# Altium schematic sheet POWER_POSITIVE.SchDoc
size A4; SheetNumber: 4; SheetTotal: 11
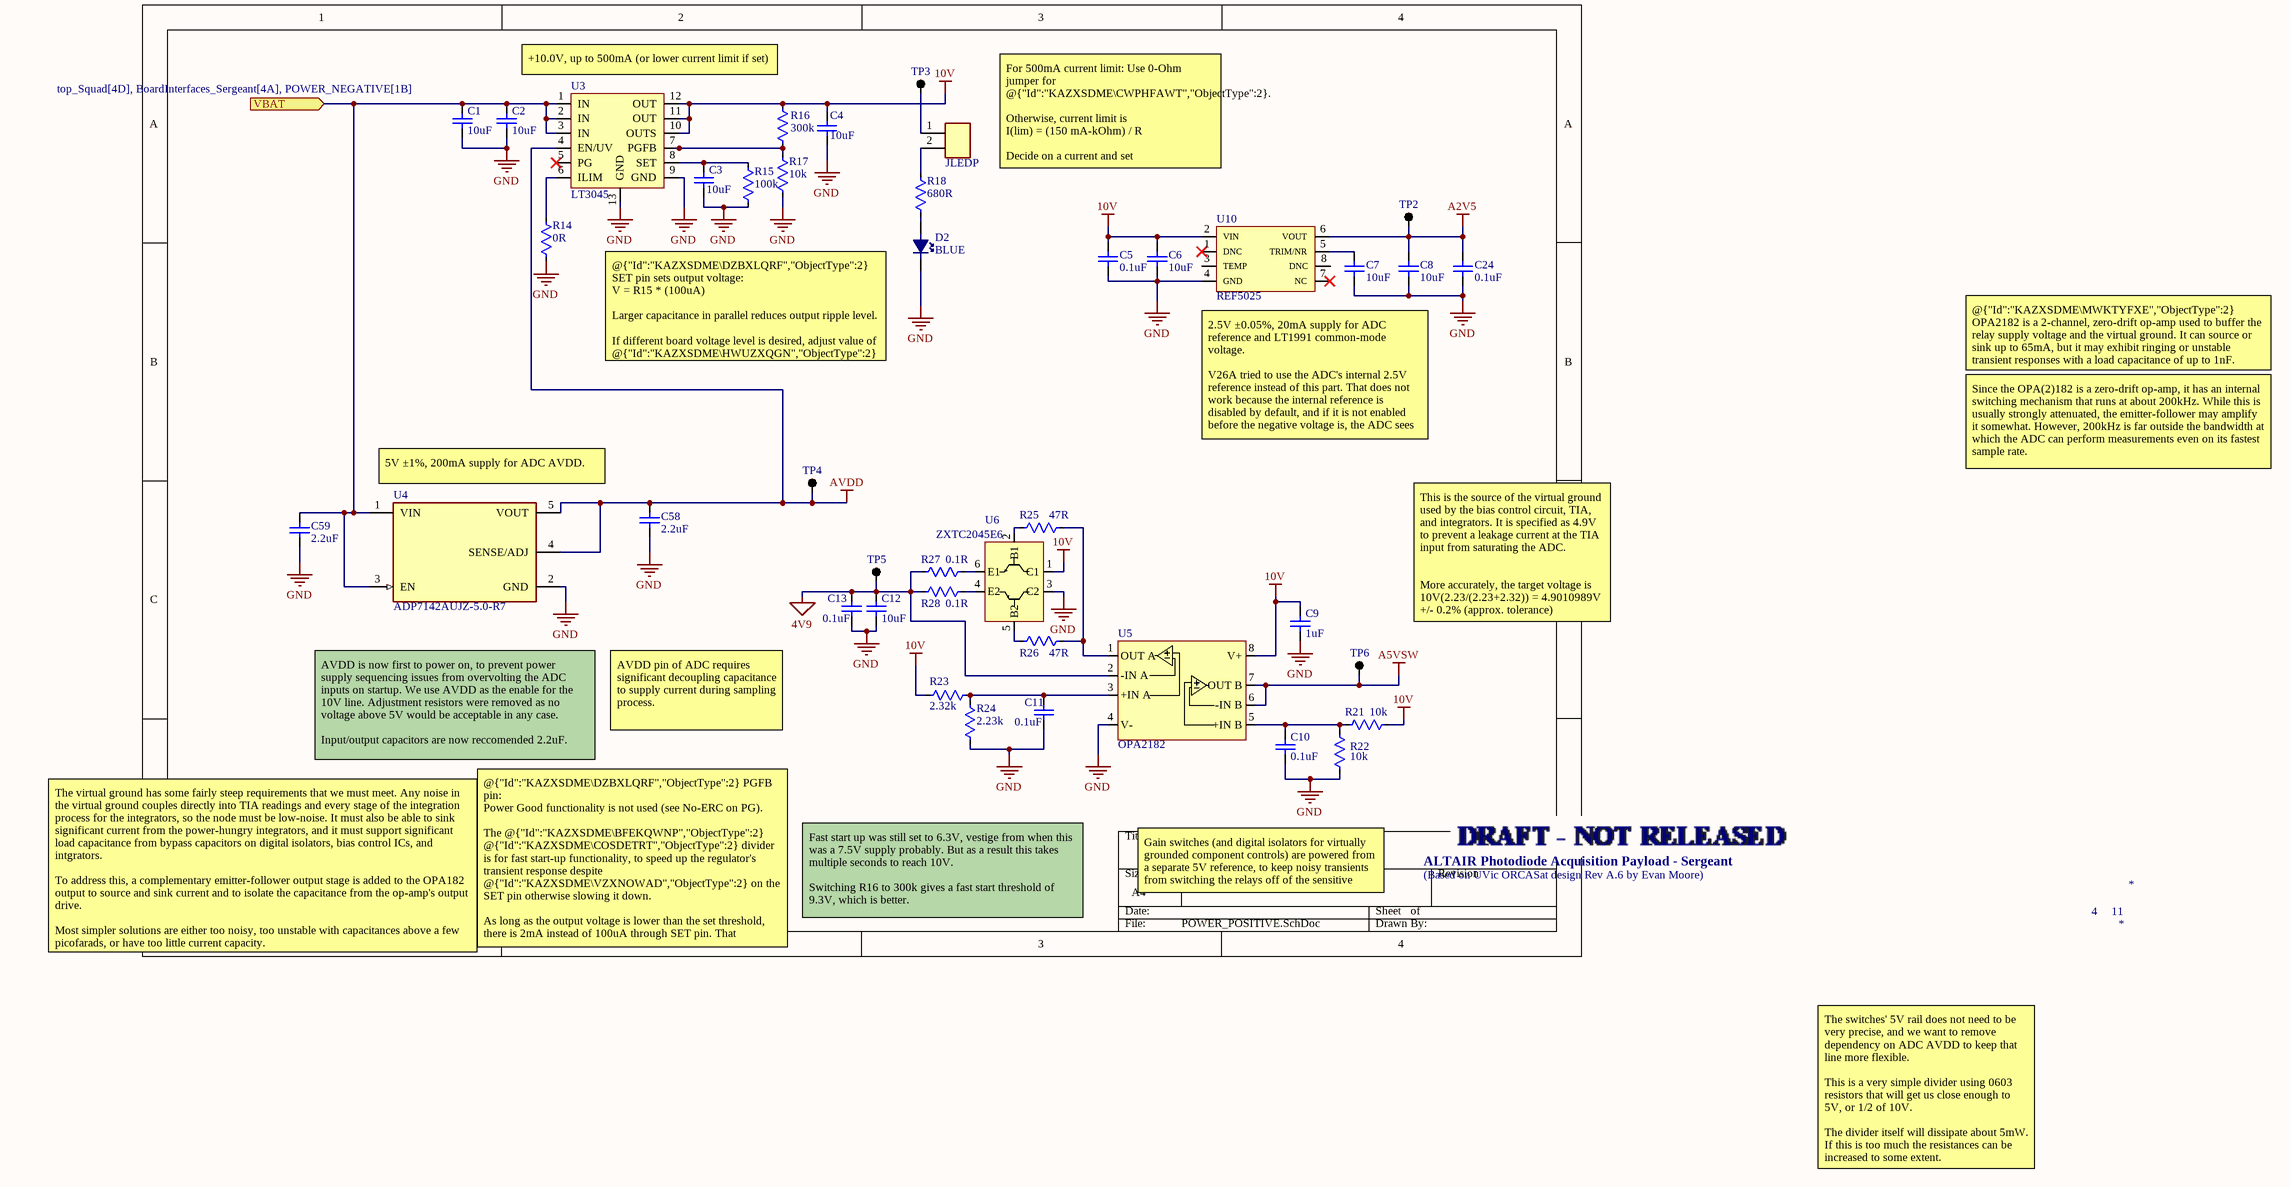
[diagram p0: POWER_POSITIVE.SchDoc]

## Parts
C1  10uF  [CAP 1206 IPC LOW DENSITY]
C2  10uF  [CAP 1206 IPC LOW DENSITY]
C3  10uF  [CAP 1206 IPC LOW DENSITY]
C4  10uF  [CAP 1206 IPC LOW DENSITY]
C5  0.1uF  [CAP 0603 IPC MID DENSITY]
C6  10uF  [CAP 0805 IPC MID DENSITY]
C7  10uF  [CAP 0805 IPC MID DENSITY]
C8  10uF  [CAP 0805 IPC MID DENSITY]
C9  1uF  [CAP 0603 IPC MID DENSITY]
C10  0.1uF  [CAP 0603 IPC MID DENSITY]
C11  0.1uF  [CAP 0603 IPC MID DENSITY]
C12  10uF  [CAP 1206 IPC LOW DENSITY]
C13  0.1uF  [CAP 0603 IPC MID DENSITY]
C24  0.1uF  [CAP 0603 IPC MID DENSITY]
C58  2.2uF  [CAP 1206 UNKNOWN]
C59  2.2uF  [CAP 1206 UNKNOWN]
D2  BLUE  [LED 0603 MID DENSITY]
JLEDP  JLED  [JUMPER 2POS 1MM PITCH THT]  (value not drawn)
R14  0R  [RES 0603 IPC MID DENSITY]
R15  100k  [RES 0603 IPC MID DENSITY]
R16  300k  [RES 0603 IPC MID DENSITY]
R17  10k  [RES 0603 IPC MID DENSITY]
R18  680R  [RES 0603 IPC MID DENSITY]
R21  10k  [RES 0603 IPC MID DENSITY]
R22  10k  [RES 0603 IPC MID DENSITY]
R23  2.32k  [RES 0603 IPC MID DENSITY]
R24  2.23k  [RES 0603 IPC MID DENSITY]
R25  47R  [RES 0402 NON-IPC SEI]
R26  47R  [RES 0402 NON-IPC SEI]
R27  0.1R  [RES 0402 NON-IPC YAGEO]
R28  0.1R  [RES 0402 NON-IPC YAGEO]
TP2  Testpoint  [TESTPOINT THT]  (value not drawn)  (no BOM)
TP3  Testpoint  [TESTPOINT THT]  (value not drawn)  (no BOM)
TP4  Testpoint  [TESTPOINT THT]  (value not drawn)  (no BOM)
TP5  Testpoint  [TESTPOINT THT]  (value not drawn)  (no BOM)
TP6  Testpoint  [TESTPOINT THT]  (value not drawn)  (no BOM)
U3  LT3045  [12-TSOP 0.65MM PITCH 3MM WIDTH EP IPC MID DENSITY]
U4  ADP7142AUJZ-5.0-R7  [SOT23-5 HIGH DENSITY AD]
U5  OPA2182  [8-TSSOP 0.65MM PITCH 4.4MM WIDTH IPC MID DENSITY]
U6  ZXTC2045E6  [SOT23-6 NON-IPC DIODES]
U10  REF5025  [8-TSOP 0.65MM PITCH 3MM WIDTH IPC MID DENSITY]

## Ports
VBAT (in, see top_Squad[4D], BoardInterfaces_Sergeant[4A], POWER_NEGATIVE[1B])

## Nets
4V9: C12.2 C13.2 R27.1 R28.1 TP5.1 U5.2(-IN_A)
10V: C4.2 C5.1 C6.2 C9.2 JLEDP.1 R16.2 R21.2 R23.2 TP3.1 U3.10(OUTS) U3.11(OUT) U3.12(OUT) U5.8(V+) U6.1(C1) U10.2(VIN)
A2V5: C8.2 C24.1 TP2.1 U10.6(VOUT)
A5VSW: TP6.1 U5.6(-IN_B) U5.7(OUT_B)
AVDD: C58.1 TP4.1 U3.4(EN/UV) U4.4(SENSE/ADJ) U4.5(VOUT)
GND: C1.1 C2.1 C3.1 C4.1 C5.2 C6.1 C7.2 C8.1 C9.1 C10.1 C11.1 C12.1 C13.1 C24.2 C58.2 C59.2 D2.1 R14.1 R15.1 R17.1 R22.1 R24.1 U3.9(GND) U3.13(GND) U4.2(GND) U5.4(V-) U6.3(C2) U10.4(GND)
VBAT: C1.2 C2.2 C59.1 U3.1(IN) U3.2(IN) U3.3(IN) U4.1(VIN) U4.3(EN) ; port VBAT
NetC3_2: C3.2 R15.2 U3.8(SET)
NetC7_1: C7.1 U10.5(TRIM/NR)
NetC10_2: C10.2 R21.1 R22.2 U5.5(+IN_B)
NetC11_2: C11.2 R23.1 R24.2 U5.3(+IN_A)
NetD2_2: D2.2 R18.1
NetJLEDP_2: JLEDP.2 R18.2
NetR14_2: R14.2 U3.6(ILIM)
NetR16_1: R16.1 R17.2 U3.7(PGFB)
NetR25_1: R25.1 U6.2(B1)
NetR25_2: R25.2 R26.2 U5.1(OUT_A)
NetR26_1: R26.1 U6.5(B2)
NetR27_2: R27.2 U6.6(E1)
NetR28_2: R28.2 U6.4(E2)

Not connected (* = marked no-connect by the designer): U3 5(PG)*; U10 1(DNC)* 3(TEMP) 7(NC)* 8(DNC)

## Notes on the sheet
- +10.0V, up to 500mA (or lower current limit if set)
- For 500mA current limit: Use 0-Ohm jumper for @{"Id":"KAZXSDME\CWPHFAWT","ObjectType":2}.
  Otherwise, current limit is
  I(lim) = (150 mA-kOhm) / R
  Decide on a current and set @{"Id":"KAZXSDME\CWPHFAWT","ObjectType":2} to the found value of R.
- @{"Id":"KAZXSDME\DZBXLQRF","ObjectType":2} SET pin sets output voltage:
  V = R15 * (100uA)
  Larger capacitance in parallel reduces output ripple level.
  If different board voltage level is desired, adjust value of @{"Id":"KAZXSDME\HWUZXQGN","ObjectType":2} as necessary according to the above equation.
- @{"Id":"KAZXSDME\MWKTYFXE","ObjectType":2} OPA2182 is a 2-channel, zero-drift op-amp used to buffer the relay supply voltage and the virtual ground. It can source or sink up to 65mA, but it may exhibit ringing or unstable transient responses with a load capacitance of up to 1nF.
- (near U4) 5V ±1%, 200mA supply for ADC AVDD.
- 2.5V ±0.05%, 20mA supply for ADC reference and LT1991 common-mode voltage.
  V26A tried to use the ADC's internal 2.5V reference instead of this part. That does not work because the internal reference is disabled by default, and if it is not enabled before the negative voltage is, the ADC sees dangerously negative voltages on analog inputs.
- Since the OPA(2)182 is a zero-drift op-amp, it has an internal switching mechanism that runs at about 200kHz. While this is usually strongly attenuated, the emitter-follower may amplify it somewhat. However, 200kHz is far outside the bandwidth at which the ADC can perform measurements even on its fastest sample rate.
- This is the source of the virtual ground used by the bias control circuit, TIA, and integrators. It is specified as 4.9V to prevent a leakage current at the TIA input from saturating the ADC.
  More accurately, the target voltage is 10V(2.23/(2.23+2.32)) = 4.9010989V +/- 0.2% (approx. tolerance)
- AVDD pin of ADC requires significant decoupling capacitance to supply current during sampling process.
- AVDD is now first to power on, to prevent power supply sequencing issues from overvolting the ADC inputs on startup. We use AVDD as the enable for the 10V line. Adjustment resistors were removed as no voltage above 5V would be acceptable in any case.
  Input/output capacitors are now reccomended 2.2uF.
- Fast start up was still set to 6.3V, vestige from when this was a 7.5V supply probably. But as a result this takes multiple seconds to reach 10V.
  Switching R16 to 300k gives a fast start threshold of 9.3V, which is better.
- Gain switches (and digital isolators for virtually grounded component controls) are powered from a separate 5V reference, to keep noisy transients from switching the relays off of the sensitive rails.
- ALTAIR Photodiode Acquisition Payload - Sergeant
- (Based on UVic ORCASat design Rev A.6 by Evan Moore)
- The virtual ground has some fairly steep requirements that we must meet. Any noise in the virtual ground couples directly into TIA readings and every stage of the integration process for the integrators, so the node must be low-noise. It must also be able to sink significant current from the power-hungry integrators, and it must support significant load capacitance from bypass capacitors on digital isolators, bias control ICs, and intgrators.
  To address this, a complementary emitter-follower output stage is added to the OPA182 output to source and sink current and to isolate the capacitance from the op-amp's output drive.
  Most simpler solutions are either too noisy, too unstable with capacitances above a few picofarads, or have too little current capacity.
- @{"Id":"KAZXSDME\DZBXLQRF","ObjectType":2} PGFB pin:
  Power Good functionality is not used (see No-ERC on PG).
  The @{"Id":"KAZXSDME\BFEKQWNP","ObjectType":2} @{"Id":"KAZXSDME\COSDETRT","ObjectType":2} divider is for fast start-up functionality, to speed up the regulator's transient response despite @{"Id":"KAZXSDME\VZXNOWAD","ObjectType":2} on the SET pin otherwise slowing it down.
  As long as the output voltage is lower than the set threshold, there is 2mA instead of 100uA through SET pin. That threshold is
  V(PG) = (0.3V)(1 + R16/R17) - I(PGFB) R56
  Where I(PGFB) is on the order of 1E-8 A.
- The switches' 5V rail does not need to be very precise, and we want to remove dependency on ADC AVDD to keep that line more flexible.
  This is a very simple divider using 0603 resistors that will get us close enough to 5V, or 1/2 of 10V.
  The divider itself will dissipate about 5mW. If this is too much the resistances can be increased to some extent.

## Library data of the parts
C1-C4 C12 = CAP: Murata GRT319R6YA106KE01D - Cap Ceramic 10uF 35V X5R 10% Pad SMD 1206 85C Automotive T/R; MF: Murata; MP: GRT319R6YA106KE01D
C5 C10 C11 C13 C24 = CAP: Kemet C0603C104K5RACAUTO - Cap Ceramic 0.1uF 50V X7R 10% 0603 125C Paper T/R; MF: Kemet; MP: C0603C104K5RACAUTO
C6-C8 = CAP: Murata GRM21BR61E106KA73L - Cap Ceramic 10uF 10% 25V X5R 0805; MF: Murata; MP: GRM21BR61E106KA73L
C9 = CAP: Murata GRT188R61H105KE13D - Cap MLCC AEC-Q200 X5R 1uF 50V 0603; MF: Murata; MP: GRT188R61H105KE13D
C58 C59 = CAP: CL31B225KBHNNNE CAP CER 2.2UF 50V X7R 1206; MF: Samsung Electro-Mechanics; MP: CL31B225KBHNNNE
D2 = LED-blue: LED BLUE CLEAR 0603 SMD; Luminous Intensity: 145mcd; Forward Current: 30mA; Forward Voltage: 3.2V; Wavelength: 470nm; Viewing Angle: 140°; Lens Style: Clear,Rectangular; Test Current: 20mA; MF: Wurth Electronics; MP: 150060BS75000; RoHS: Yes; Category: LEDs; Stock 1: 66561; Mount: Surface Mount; Case/Package: 0603; Color: Blue; Case Code (Metric): 1608; Case Code (Imperial): 0603; Min Operating Temperature: -40°C; Max Operating Temperature: 85°C; Package Quantity: 4000; Packaging: Cut Tape; Dominant Wavelength: 470nm; Length: 1.6mm; Height: 0.7mm; Width: 0.8mm; REACH SVHC: Unknown; ComponentLink1URL: https://datasheet.ciiva.com/29563/150060bs75000-29563034.pdf?src-supplier=Digi-Key; ComponentLink1Description: https://datasheet.ciiva.com/29563/150060bs75000-29563034.pdf?src-supplier=Digi-Key; ComponentLink2URL: https://datasheet.ciiva.com/29279/759426-da-01-en-chipled-0603-w-kl-blau-150060bs75000-29279193.pdf?src-supplier=Conrad; ComponentLink2Description: https://datasheet.ciiva.com/29279/759426-da-01-en-chipled-0603-w-kl-blau-150060bs75000-29279193.pdf?src-supplier=Conrad; ComponentLink3URL: https://datasheet.ciiva.com/29563/150060bs75000-29563035.pdf?src-supplier=Digi-Key; ComponentLink3Description: https://datasheet.ciiva.com/29563/150060bs75000-29563035.pdf?src-supplier=Digi-Key; ComponentLink4URL: https://datasheet.ciiva.com/29563/150060bs75000-29563036.pdf?src-supplier=Digi-Key; ComponentLink4Description: https://datasheet.ciiva.com/29563/150060bs75000-29563036.pdf?src-supplier=Digi-Key; ComponentLink5URL: https://datasheet.ciiva.com/22656/1911343-22656939.pdf?src-supplier=Element14; ComponentLink5Description: https://datasheet.ciiva.com/22656/1911343-22656939.pdf?src-supplier=Element14; ComponentLink6URL: https://datasheet.ciiva.com/48430/150060bs75000-eng-tds-48430039.pdf?src-supplier=Distrelec; ComponentLink6Description: https://datasheet.ciiva.com/48430/150060bs75000-eng-tds-48430039.pdf?src-supplier=Distrelec; Supplier 1: Digi-Key; Supplier Part Number 1: 732-4966-1-ND
JLEDP = BC020-02-A-0200-0300-L-G: 2x1 Header THT 1mm Pitch; MF: GCT (GLOBAL CONNECTOR TECHNOLOGY); Datasheet Link: https://gct.co/connector/bc020; MP: BC020-02-A-0200-0300-L-G; Mouser Part Number: 640-BC02002A02300LG; Mouser Price/Stock: https://www.mouser.co.uk/ProductDetail/GCT/BC020-02-A-0200-0300-L-G?qs=KUoIvG%2F9IlakgsojlT9P9w%3D%3D
R14 = RES: Vishay CRCW06030000Z0EA - Res 0 Ohms 1/8W SMD 0603; MF: Vishay Dale; MP: CRCW06030000Z0EA
R15 = RES: Panasonic ERA-3ARB104V - Res SMD 0603 0.1% 0.10W T.C. 10ppm 100K; MF: Panasonic Electronic Components; MP: ERA-3ARB104V
R16 = RES: Vishay MCT06030C3003FP500 - Res SMD 300kOhm 1% 1/10W 0603; MF: Vishay Dale; MP: MCT06030C3003FP500
R17 R21 R22 = RES: Vishay CRCW060310K0FKEA SMD 0603 10k, CRCW e3 Series, 75V, thick film, 100mW; MF: Vishay Dale; MP: CRCW060310K0FKEA
R18 = RES: Panasonic ERJ-3EKF6800V - Res SMD 680 Ohm 1% 1/10W 0603; MF: Panasonic Electronic Components; MP: ERJ-3EKF6800V
R23 = RES: Vishay TNPW06032K32BEEA - Res 2.32k 0.1% 0.21W SMD 0603; MF: Vishay Dale; MP: TNPW06032K32BEEA
R24 = RES: KOA Speer RN73R1JTTD2231B25 - Res 2.23k 0.1% 1/10W SMD 0603; MF: KOA Speer Electronics, Inc.; MP: RN73R1JTTD2231B25
R25 R26 = RES: Stackpole RMCF0402JT47R0 - Res 47Ohm 5% 0.063W 0402 Thick Film AEC-Q200 compliant; MF: Stackpole Electronics Inc.; MP: RMCF0402JT47R0
R27 R28 = RES: Yageo RL0402JR-070R1L - Res 0.1Ohm 5% 1/16W SMD 0402; MF: YAGEO; MP: RL0402JR-070R1L
U3 = LT3045: 20V 500mA Ultralow Noise Ultrahigh PSRR Adjustable Linear Regulator 260V Dropout MSOP-12; Output Voltage: 15V; Dropout Voltage: 260mV; Number of Regulators: 1; Min Current Limit: 570mA; MF: Analog Devices / Linear Technology; MP: LT3045EMSE#PBF; RoHS: Yes; Stock 1: 1588; Case/Package: MSOP; Min Operating Temperature: -40°C; Max Operating Temperature: 125°C; Output Current: 500mA; ComponentLink1URL: http://www.farnell.com/datasheets/2163219.pdf?src-supplier=Farnell; ComponentLink1Description: http://www.farnell.com/datasheets/2163219.pdf?src-supplier=Farnell; ComponentLink2URL: http://www.linear.com/docs/55649?src-supplier=Digi-Key; ComponentLink2Description: http://www.linear.com/docs/55649?src-supplier=Digi-Key; Supplier 1: Digi-Key; Supplier Part Number 1: LT3045EMSE#PBF-ND
U4 = ADP7142AUJZ-R7: 1.2-40V 200mA Low Noise CMOS LDO Adjustable Linear Regulator TSOT23; Nominal Supply Current: 50-180uA; Output Type: AdjustableProgrammable; Max Supply Voltage: 40V; Number Of Outputs: 1; Dropout Voltage: 200mV; Output Voltage: 1.2-5V; Min Supply Voltage: 2.7V; Max Junction Temp: +150°C; MF: Analog Devices; Accuracy Percentage: 0.8%; Ambient Temperature Range Low: -40°C; ComponentLink2Description: Datasheet; Digikey Description: IC REG LIN POS ADJ 200MA TSOT23; Device Class L1: Integrated Circuits (ICs); Mouser Description: LDO Regulator Pos 1.5V to 5V 0.2A 5-Pin TSOT-23 T/R; Height: 1mm; Temperature Range Low: -40°C; Output Current: 200mA; Device Class L3: Voltage Regulators - Linear; Octopart: https://octopart.com/adp7142aujz-r7-analog+devices-38928114; Category: IC; MP: ADP7142AUJZ-5.0-R7; ComponentLink2URL: https://www.analog.com/media/en/technical-documentation/data-sheets/ADP7142.pdf; Device Class L2: Power Management ICs; Package: UJ-5; Automotive: No; Lead Free: Yes; Ambient Temperature Range High: +125°C; Temperature: -40°C to +125°C; Temperature Range High: +125°C; RoHS: TRUE; Manufacturer: Analog Devices; Manufacturer Part Number: ADP7142AUJZ-R7
U5 = OPA2182IDBV: Op amp, 2 Channel, Highest-precision, 36-V, 5-MHz, single, low-noise, zero-drift, MUX-friendly amplifier 8VSSOP -40 to 125; MF: Texas Instruments; MP: OPA2182IDGKR
U6 = ZXTC2045E6: BJT Array, 1NPN 1PNP, VCE(sat) 375mV, hFE 300, Breakdown 30V, 6-SOT-23; MF: Diodes Incorporated; MP: ZXTC2045E6TA
U10 = REF5050IDGKR: 2.5V±0.05% Voltage Reference 8VSSOP; MF: Texas Instruments; MP: REF5025IDGKR; Number of Channels: 1; Max Input Voltage: 18V; Output Voltage: 5V; Min Input Voltage: 5.2V; Nominal Supply Current: 800uA; Tolerance: 0.05%; Max Output Current: 10mA; Operating Supply Current: 1.2mA; Temperature Coefficient: 3ppm/°C; Reference Type: Series; Output Type: Fixed; Supplier 1: Digi-Key; RoHS: Yes; Category: Voltage References; Stock 1: 2539; Pricing 1: 1=6.18000, 10=5.58100, 25=5.32200, 100=4.41320, 250=4.02380, 500=3.76420, 1000=3.45268 (USD); Case/Package: VSSOP; Number of Pins: 8; Weight: 0.00067oz; Min Operating Temperature: -40°C; Max Operating Temperature: 125°C; Packaging: Tape and Reel; Package Quantity: 1; Min Output Voltage: 5V; Output Current: 10mA; Max Output Voltage: 5V; Quiescent Current: 800uA; Radiation Hardening: No; Lead Free: Lead Free; ComponentLink1URL: https://datasheet.ciiva.com/2007/ref5020-2007532.pdf?src-supplier=Digi-Key; ComponentLink1Description: https://datasheet.ciiva.com/2007/ref5020-2007532.pdf?src-supplier=Digi-Key; ComponentLink2URL: https://datasheet.ciiva.com/14197/ref5050-14197084.pdf?src-supplier=Avnet; ComponentLink2Description: https://datasheet.ciiva.com/14197/ref5050-14197084.pdf?src-supplier=Avnet; ComponentLink3URL: https://datasheet.ciiva.com/2007/ref5020-2007533.pdf?src-supplier=Digi-Key; ComponentLink3Description: https://datasheet.ciiva.com/2007/ref5020-2007533.pdf?src-supplier=Digi-Key; ComponentLink4URL: https://datasheet.ciiva.com/2007/ref5020-2007534.pdf?src-supplier=Digi-Key; ComponentLink4Description: https://datasheet.ciiva.com/2007/ref5020-2007534.pdf?src-supplier=Digi-Key; ComponentLink5URL: https://datasheet.ciiva.com/41462/001014471-da-01-en-ic-vref-series-ref5050idgkr-vssop-8-tid-41462326.pdf?src-supplier=Conrad; ComponentLink5Description: https://datasheet.ciiva.com/41462/001014471-da-01-en-ic-vref-series-ref5050idgkr-vssop-8-tid-41462326.pdf?src-supplier=Conrad; Supplier Part Number 1: 296-27505-1-ND